# Altium schematic sheet Yusynth VCA - Source.SchDoc
size Letter
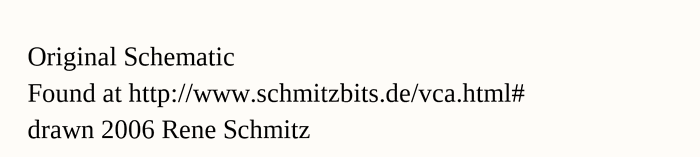
[diagram p0: Yusynth VCA - Source.SchDoc]

## Notes on the sheet
- Original Schematic
- Found at http://www.schmitzbits.de/vca.html#
- drawn 2006 Rene Schmitz